# EAGLE schematic shield2 (EAGLE 7.6.0)
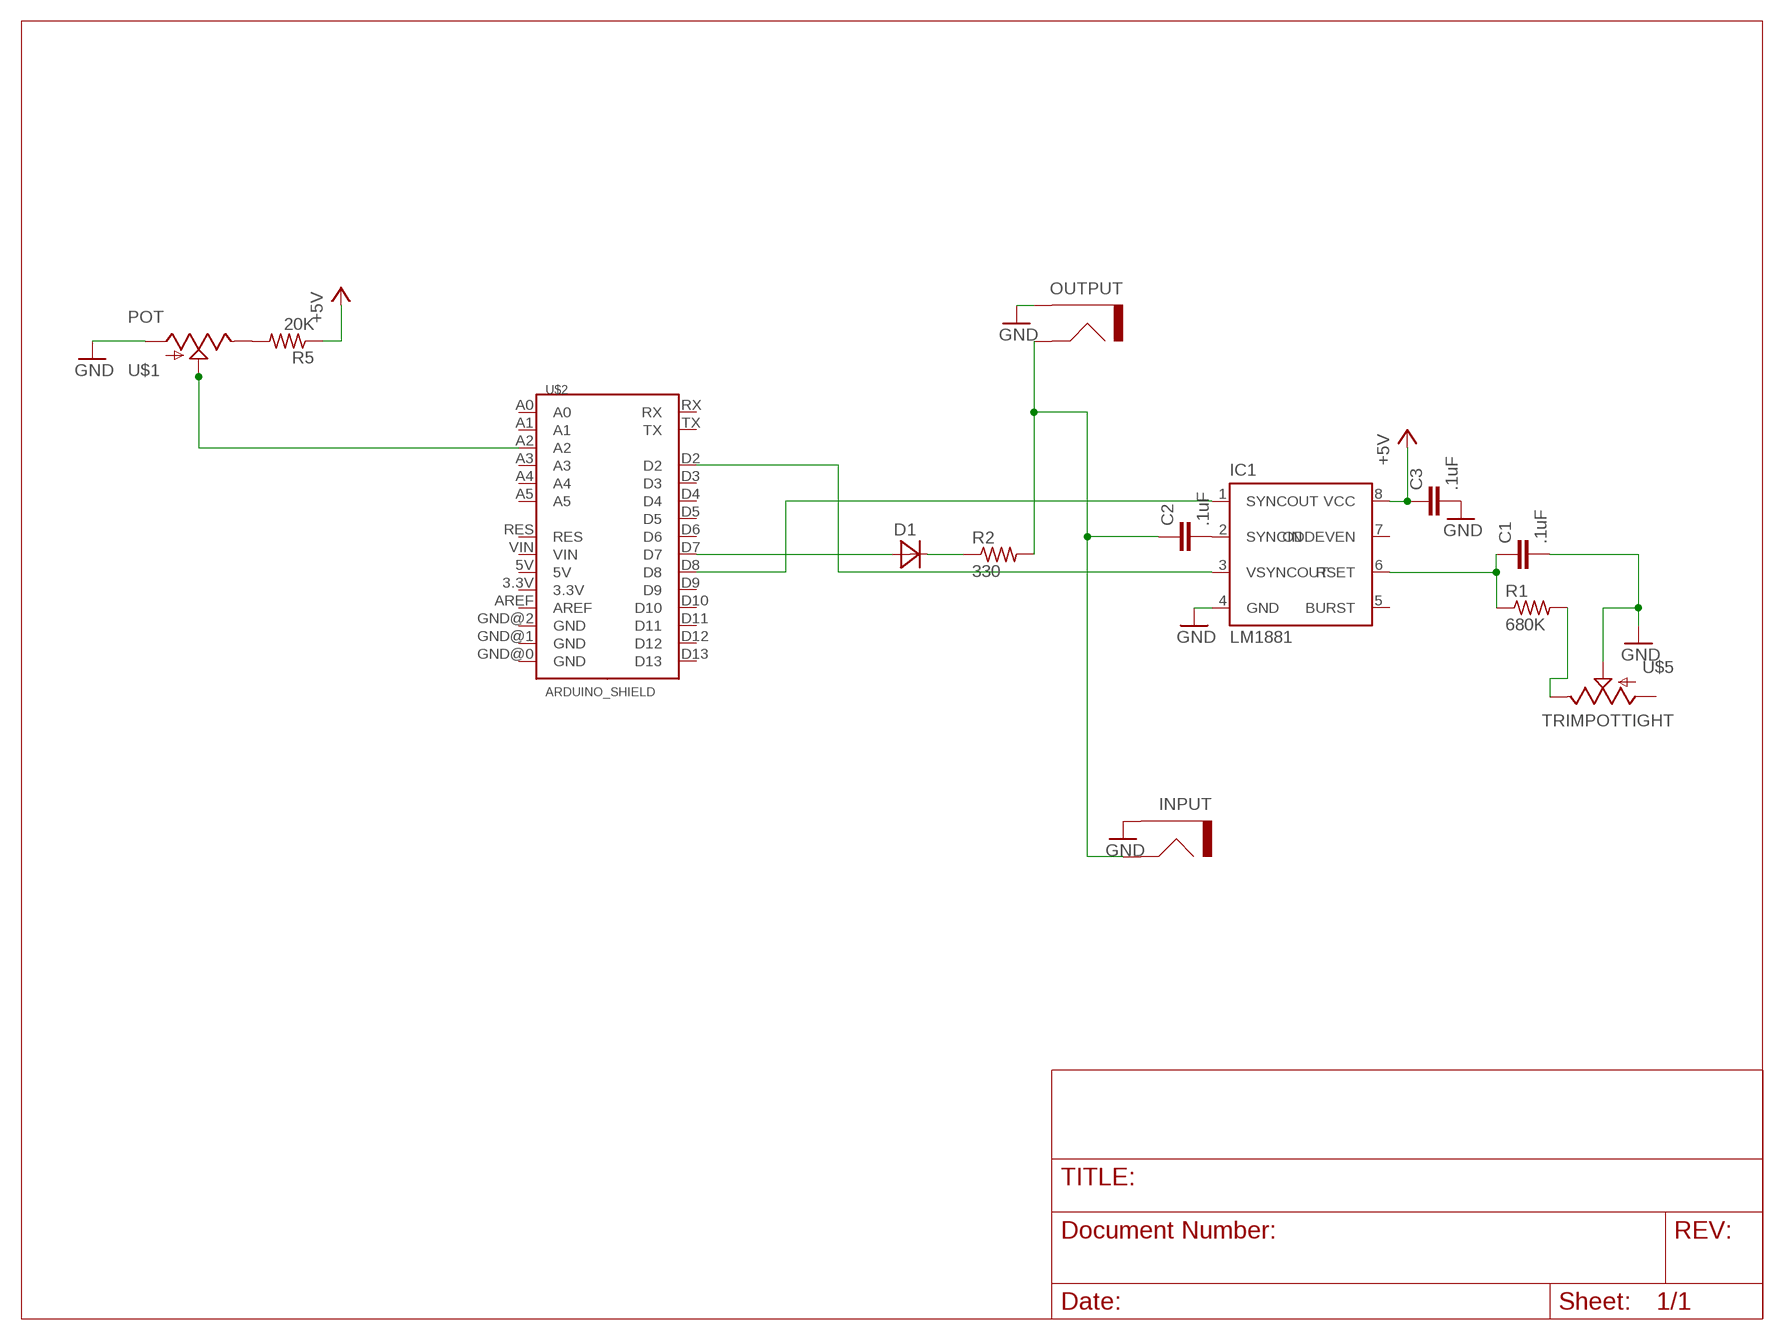
[diagram p0: schematic, sheet 1]
FRAME1 (LETTER_L): DRAWING_NAME: tidal-video-pulse

## Parts
C1  .1uF  CAPSMALL  [CAP-CERAMIC-SMALL]
C2  .1uF  CAPSMALL  [CAP-CERAMIC-SMALL]
C3  .1uF  CAPSMALL  [CAP-CERAMIC-SMALL]
D1  1N4148  [D35-10]
IC1  LM1881  [DIL08]
INPUT  RCAJACK  [RCA]
OUTPUT  RCAJACK  [RCA]
R1  680K  R-US  [0207/10]
R2  330  R-US  [0207/10]
R5  20K  R-US  [0207/10]
U$1  POT  [TRIMMERPOT]
U$2  ARDUINO_SHIELD  [DUEMILANOVE_SHIELD]
U$5  TRIMPOTTIGHT  [TRIM_POT_TIGHT]

## Nets
+5V: C3.1 IC1.8(VCC) R5.1
A2: U$1.2(WIPER) U$1.4(WIPER) U$2.A2
GND: C1.2 C3.2 IC1.4(GND) INPUT.BARREL(GND) OUTPUT.BARREL(GND) U$1.1 U$5.2
N$3: D1.C R2.1
N$4: R1.2 U$5.3
N$5: R5.2 U$1.3
N$29: C2.2 IC1.2(SYNCIN)
RSET: C1.1 IC1.6(RSET) R1.1
SYNCOUT: IC1.1(SYNCOUT) U$2.D8
VIDEOINPUT: C2.1 INPUT.P$2(SIGNAL) OUTPUT.P$2(SIGNAL) R2.2
VIDEOOUT: D1.A U$2.D7
VSYNC: IC1.3(VSYNCOUT) U$2.D2
Unconnected: IC1.5(BURST) IC1.7(ODDEVEN) U$2.3.3V U$2.5V U$2.A0 U$2.A1 U$2.A3 U$2.A4 U$2.A5 U$2.AREF U$2.D3 U$2.D4 U$2.D5 U$2.D6 U$2.D9 U$2.D10 U$2.D11 U$2.D12 U$2.D13 U$2.GND@0(GND) U$2.GND@1(GND) U$2.GND@2(GND) U$2.RES U$2.RX U$2.TX U$2.VIN U$5.1

## Library data of the parts
C1-C3 = nootropicdesign:CAP: Unpolarized capacitor
D1 = nootropicdesign:1N4148
IC1 = lm1881:LM1881
INPUT OUTPUT = nootropicdesign:RCAJACK: RCA jack
R1 R2 R5 = nootropicdesign:R-US: Resistor
U$1 = nootropicdesign:POT
U$2 = nootropicdesign:ARDUINO_SHIELD
U$5 = nootropicdesign:TRIMPOT